# Altium schematic sheet PhotoResistor.SchDoc
size A
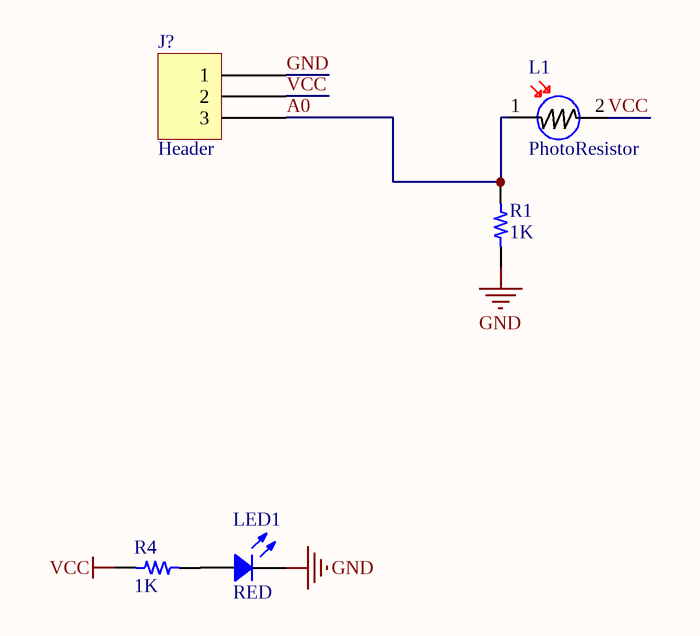
[diagram p0: PhotoResistor.SchDoc]

## Parts
J?  Header  [JST XH B3B-XH-A - RIGHT]
L1  PhotoResistor  [PhotoResistor]
LED1  RED  [LED 0805/2012 RED]
R1  1K  [RES 1206/3216]
R4  1K  [RES 1206/3216]

## Nets
GND: J?.1 LED1.2 R1.1
VCC: J?.2 L1.2 R4.2
A0: J?.3 L1.1 R1.2
NetLED1_1: LED1.1 R4.1

## Library data of the parts
J? = 3 Pin
LED1 = LED: Chip LED; Value: Green
R1 R4 = Resistor: SMT Resistor; Value: 1K